# Altium project RaceDAQ 0.1.0.PrjPcb
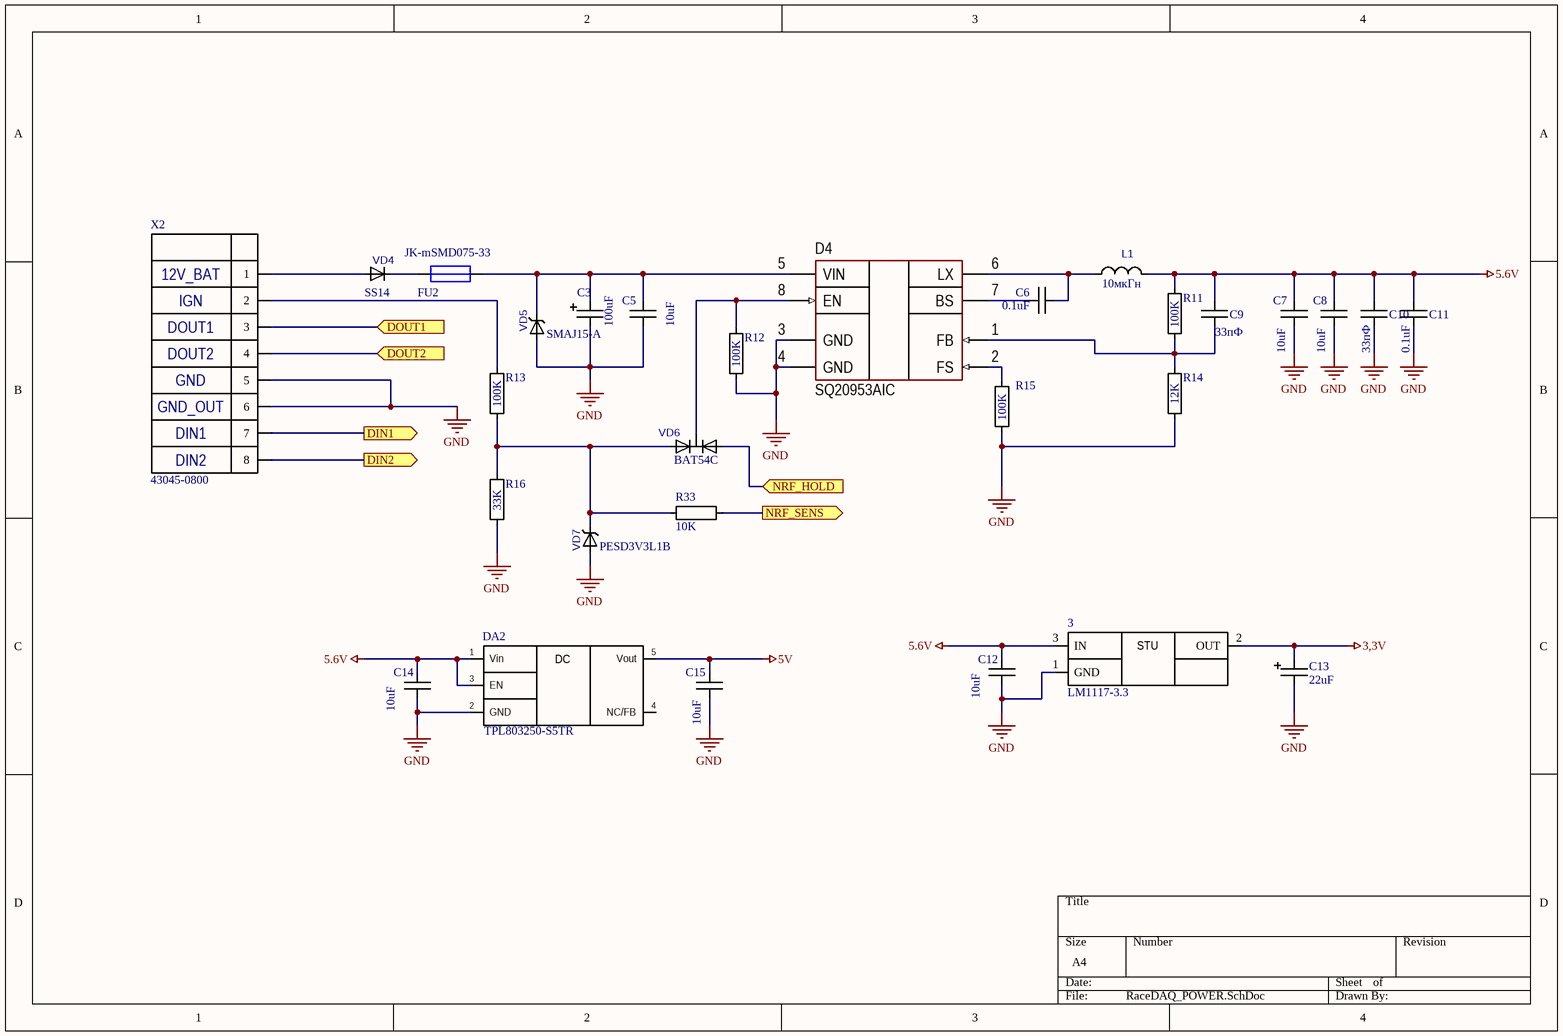
[diagram p0: RaceDAQ_POWER.SchDoc]
4 sheets, 91 parts. Net scope: flat (ports and power ports of the same name join across sheets).
Board file: PCB1.PcbDoc
Sheets:
  RaceDAQ_POWER.SchDoc
  RaceDAQ_IN_OUT.SchDoc
  RaceDAQ_ANALOG.SchDoc
  RaceDAQ_MCU.SchDoc

## Sheet RaceDAQ_POWER.SchDoc
size A4; SheetNumber: 1; SheetTotal: 4

### Parts
3  LM1117-3.3  [SOT230P700X180-4L40N]
C3  100uF  [CAPPRD250W50D680H1250]
C5  10uF  [CAPC3216X130L50N]
C6  0.1uF  [CAPC1608X90L25N]
C7  10uF  [CAPC3216X130L50N]
C8  10uF  [CAPC3216X130L50N]
C9  33пФ  [CAPC1608X90L25N]
C10  33пФ  [CAPC1608X90L25N]
C11  0.1uF  [CAPC1608X90L25N]
C12  10uF  [CAPC3216X130L50N]
C13  22uF  [CAPPM3216X180]
C14  10uF  [CAPC3216X130L50N]
C15  10uF  [CAPC3216X130L50N]
D4  (no value)  [8-SOT]
DA2  TPL803250-S5TR  [SOT95P280X145-5L30N]
FU2  JK-mSMD075-33  [FUSE: 1812]
L1  10мкГн  [MPH0630]
R11  100K  [RESC1608X55L25N]
R12  100K  [RESC1608X55L25N]
R13  100K  [RESC1608X55L25N]
R14  12K  [RESC1608X55L25N]
R15  100K  [RESC1608X55L25N]
R16  33K  [RESC1608X55L25N]
R33  10K  [RESC2012X60L35N]
VD4  SS14  [DIOM5436X247N]
VD5  SMAJ15-A  [DIOM5126X229]
VD6  BAT54C  [SOT95P240X110-3L16]
VD7  PESD3V3L1B  [SODFL1608X65N]
X2  43045-0800  [43045-0800]

### Ports
DIN1 (out), DIN2 (out), DOUT1 (in), DOUT2 (in), NRF_HOLD (in), NRF_SENS (out)

### Nets
3,3V: 3.2(OUT) C13.1
5.6V: 3.3(IN) C7.1 C8.1 C9.1 C10.1 C11.1 C12.1 C14.1 DA2.1(Vin) DA2.3(EN) L1.2 R11.1
5V: C15.1 DA2.5(Vout)
GND: 3.1(GND) C3.2 C5.2 C7.2 C8.2 C10.2 C11.2 C12.2 C13.2 C14.2 C15.2 D4.3(GND) D4.4(GND) DA2.2(GND) R12.2 R14.2 R15.2 R16.2 VD5.A VD7.A X2.5 X2.6
NetC3_1: C3.1 C5.1 D4.5(VIN) FU2.2 VD5.C
NetC6_1: C6.1 D4.7(BS)
NetC6_2: C6.2 D4.6(LX) L1.1
NetC9_2: C9.2 D4.1(FB) R11.2 R14.1
NetD4_2: D4.2(FS) R15.1
NetD4_8: D4.8(EN) R12.1 VD6.3
NetFU2_1: FU2.1 VD4.C
NetFU3_1: X2.3 ; port DOUT1
NetFU4_1: X2.4 ; port DOUT2
NetR13_1: R13.1 X2.2
NetR13_2: R13.2 R16.1 R33.2 VD6.1 VD7.C
NetR23_1: X2.7 ; port DIN1
NetR27_1: X2.8 ; port DIN2
NetR33_1: R33.1 ; port NRF_SENS
NetU_30: VD6.2 ; port NRF_HOLD
NetVD4_A: VD4.A X2.1

Not connected (* = marked no-connect by the designer): DA2 4(NC/FB)

### Notes on the sheet
- (near X2) 12V_BAT
- (near X2) IGN
- (near X2) DOUT1
- (near X2) DOUT2
- (near X2) GND
- (near X2) GND_OUT
- (near X2) DIN1
- (near X2) DIN2
- (in symbol LM1117-3.3) STU
- (in symbol TPS763xx) DC

### Library data of the parts
C3 = Radial 6.3x11: PartNumber: EEUFR1E101; Voltage: 25V; Type: Radial 6.3x11; Value: 100uF
C5 C7 C8 C12 C14 C15 = C1206: PartNumber: GRM31CR61E106KA12L; Type: C1206; Voltage: 25V; Value: 10uF
C6 C11 = C0603: PartNumber: CL10B104KB8NNNC; Type: C0603; Voltage: 50V; Value: 0.1uF
C9 C10 = C0603: PartNumber: CL10C330JB8NNNC,; Type: C0603; Voltage: 50V; Value: 33пФ
C13 = CASEA: PartNumber: 293D226X9010A2TE3; Type: CASEA; Value: 22uF
D4 = SQ20953AIC: Buck converter; Manufacturer: Silergy; ValueManufacturerPartNumber: DC/DC buck converter, input 4...60V, 2.1MHz, output 0.765...55V, 0.6A, -40...+125°C, SOT23-8; VoltageInput: input 4...60V; Frequency: 2.1MHz; CurrentOutput: 0.6A; VoltageOutput: output 0.765...55V; HelpURL: https://www.chipdip.ru/product/sq20953aic-silergy-8027122657; Package: SOT23-8; ComponentType: DC/DC buck converter; Temperature: -40...+125°C; PartNumber: SQ20953AIC
DA2 = TPS763xx: Type: TPL803225-S5TR-S; Value: TPL803250-S5TR
FU2 = JK-mSMD075-33: Предохраниетель ток срабатывания 1,5А, ток удержания 750мА; Manuf: JINRUI; Current: 1.5A
L1 = MPH0630: PartNumber: MWSA0603S-100MT; Type: MPH0630; Value: 10мкГн
R11-R13 R15 = R0603: PartNumber: RC0603FR-07100KL; Type: R0603; Value: 100K
R14 = R0603: PartNumber: RC0603FR-0712KL; Type: R0603; Value: 12K
R16 = R0603: PartNumber: RC0603FR-0733KL; Type: R0603; Value: 33K
R33 = R0805: Type: R0805; Value: 10K
VD4 = SS26T3G: Type: SS26T3G; Value: SS14
VD5 = SMAJ-A: Type: SMAJ-A; Value: SMAJ15-A
VD6 = BAT54: Type: BAT54; Value: BAT54C
VD7 = PESDxS1UB: Type: PESDxS1UB; Value: PESD3V3L1B
3 = LM1117-3.3: Type: LM1117-3.3; Value: LM1117-3.3
X2 = 43045-0800: Type: 43045-0800; Value: 43045-0800

## Sheet RaceDAQ_IN_OUT.SchDoc
size A4; SheetNumber: 2; SheetTotal: 4
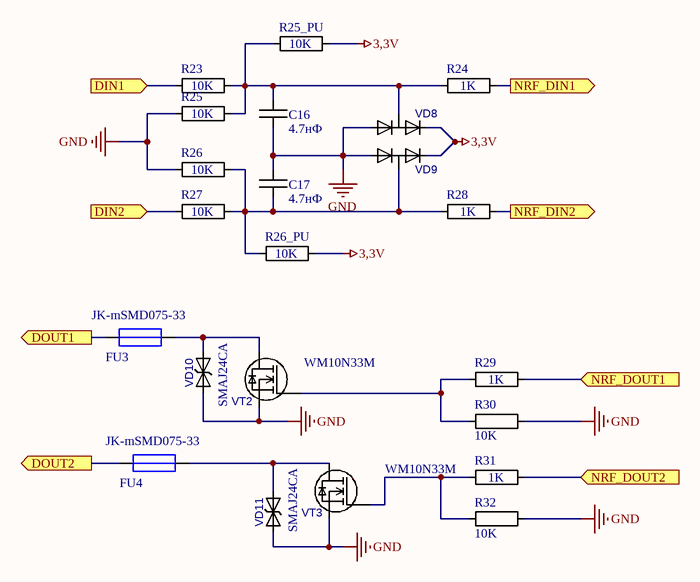
[diagram p1: RaceDAQ_IN_OUT.SchDoc]

### Parts
C16  4.7нФ  [CAPC1608X90L25N]
C17  4.7нФ  [CAPC1608X90L25N]
FU3  JK-mSMD075-33  [FUSE: 1812]
FU4  JK-mSMD075-33  [FUSE: 1812]
R23  10K  [RESC2012X60L35N]
R24  1K  [RESC1608X55L25N]
R25  10K  [RESC2012X60L35N]
R25_PU  10K  [RESC2012X60L35N]
R26  10K  [RESC2012X60L35N]
R26_PU  10K  [RESC2012X60L35N]
R27  10K  [RESC2012X60L35N]
R28  1K  [RESC1608X55L25N]
R29  1K  [RESC1608X55L25N]
R30  10K  [RESC2012X60L35N]
R31  1K  [RESC1608X55L25N]
R32  10K  [RESC2012X60L35N]
VD8  BAT54S  [SOT95P240X110-3L16]  (value not drawn)
VD9  BAT54S  [SOT95P240X110-3L16]  (value not drawn)
VD10  SMAJ24CA  [DIOM5126X229]
VD11  SMAJ24CA  [DIOM5126X229]
VT2  WM10N33M  [SOT95P240X110-3L10]
VT3  WM10N33M  [SOT95P240X110-3L10]

### Ports
DIN1 (in), DIN2 (in), DOUT1 (out), DOUT2 (out), NRF_DIN1 (out), NRF_DIN2 (out), NRF_DOUT1 (in), NRF_DOUT2 (in)

### Nets
3,3V: R25_PU.1 R26_PU.1 VD8.2 VD9.2
GND: C16.1 C17.2 R25.2 R26.1 R30.1 R32.1 VD8.1 VD9.1 VD10.A VD11.A VT2.2 VT3.2
NetC16_2: C16.2 R23.2 R24.1 R25.1 R25_PU.2 VD8.3
NetC17_1: C17.1 R26.2 R26_PU.2 R27.2 R28.1 VD9.3
NetFU3_1: FU3.1 ; port DOUT1
NetFU3_2: FU3.2 VD10.C VT2.3
NetFU4_1: FU4.1 ; port DOUT2
NetFU4_2: FU4.2 VD11.C VT3.3
NetR23_1: R23.1 ; port DIN1
NetR24_2: R24.2 ; port NRF_DIN1
NetR27_1: R27.1 ; port DIN2
NetR28_2: R28.2 ; port NRF_DIN2
NetR29_1: R29.1 R30.2 VT2.1
NetR29_2: R29.2 ; port NRF_DOUT1
NetR31_1: R31.1 R32.2 VT3.1
NetR31_2: R31.2 ; port NRF_DOUT2

### Library data of the parts
C16 C17 = C0603: Type: C0603; Value: 4.7нФ
FU3 FU4 = JK-mSMD075-33: as FU2 on sheet RaceDAQ_POWER
R23 R25 R25_PU R26 R26_PU R27 R30 R32 = R0805: Type: R0805; Value: 10K
R24 R28 R29 R31 = R0603: Type: R0603; Value: 1K
VD10 VD11 = SMAJ-CA: Type: SMAJ-CA; Value: SMAJ24CA
VT2 VT3 = AO3400: Type: AO3400; Value: WM10N33M
VD8 VD9 = BAT54S: Type: BAT54S; Value: BAT54S

## Sheet RaceDAQ_ANALOG.SchDoc
size A4; SheetNumber: 3; SheetTotal: 4
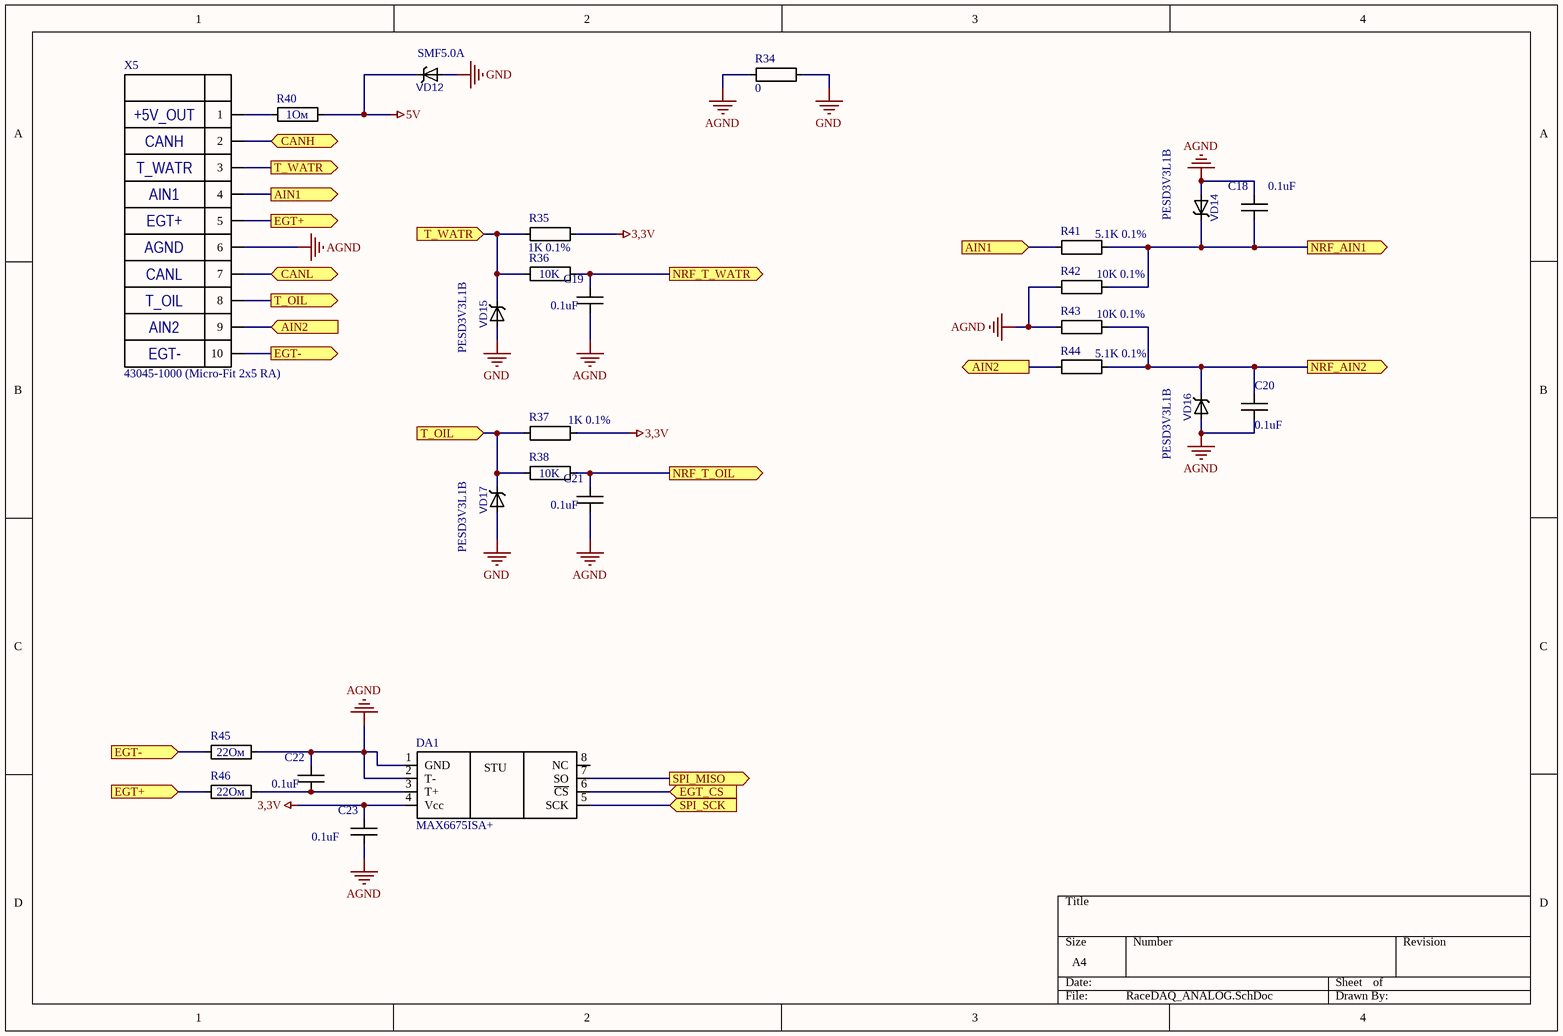
[diagram p2: RaceDAQ_ANALOG.SchDoc]

### Parts
C18  0.1uF  [CAPC1608X90L25N]
C19  0.1uF  [CAPC1608X90L25N]
C20  0.1uF  [CAPC1608X90L25N]
C21  0.1uF  [CAPC1608X90L25N]
C22  0.1uF  [CAPC1608X90L25N]
C23  0.1uF  [CAPC1608X90L25N]
DA1  MAX6675ISA+  [SOIC127P600X175-8L87N]
R34  0  [RESC2012X60L35N]
R35  1K 0.1%  [RESC1608X55L25N]
R36  10K  [RESC2012X60L35N]
R37  1K 0.1%  [RESC1608X55L25N]
R38  10K  [RESC2012X60L35N]
R40  1Ом  [RESC1608X55L25N]
R41  5.1K 0.1%  [RESC1608X55L25N]
R42  10K 0.1%  [RESC1608X55L25N]
R43  10K 0.1%  [RESC1608X55L25N]
R44  5.1K 0.1%  [RESC1608X55L25N]
R45  22Ом  [RESC1608X55L25N]
R46  22Ом  [RESC1608X55L25N]
VD12  SMF5.0A  [SODFL3617X110]
VD14  PESD3V3L1B  [SODFL1608X65N]
VD15  PESD3V3L1B  [SODFL1608X65N]
VD16  PESD3V3L1B  [SODFL1608X65N]
VD17  PESD3V3L1B  [SODFL1608X65N]
X5  43045-1000 (Micro-Fit 2x5 RA)  [43045-1000]

### Ports
AIN1 (in), AIN1 (out), AIN2 (in), AIN2 (out), CANH (bidir), CANL (bidir), EGT+ (in), EGT+ (out), EGT- (in), EGT- (out), EGT_CS (in), NRF_AIN1 (out), NRF_AIN2 (out), NRF_T_OIL (out), NRF_T_WATR (out), SPI_MISO (out), SPI_SCK (in), T_OIL (in), T_OIL (out), T_WATR (in), T_WATR (out)

### Nets
3,3V: C23.2 DA1.4(Vcc) R35.2 R37.2
5V: R40.2 VD12.C
AGND: C18.2 C19.1 C20.1 C21.1 C22.2 C23.1 DA1.1(GND) DA1.2(T-) R34.2 R42.1 R43.1 R45.2 VD14.A VD16.A X5.6
GND: R34.1 VD12.A VD15.A VD17.A
NetC18_1: C18.1 R41.2 R42.2 VD14.C ; port NRF_AIN1
NetC19_2: C19.2 R36.2 ; port NRF_T_WATR
NetC20_2: C20.2 R43.2 R44.2 VD16.C ; port NRF_AIN2
NetC21_2: C21.2 R38.2 ; port NRF_T_OIL
NetC22_1: C22.1 DA1.3(T+) R46.2
NetD2_2: DA1.5(SCK) ; port SPI_SCK
NetD2_4: DA1.7(SO) ; port SPI_MISO
NetD2_8: X5.7 ; port CANL
NetD2_9: X5.2 ; port CANH
NetDA1_6: DA1.6(~{CS}) ; port EGT_CS
NetR35_1: R35.1 R36.1 VD15.C X5.3 ; port T_WATR
NetR37_1: R37.1 R38.1 VD17.C X5.8 ; port T_OIL
NetR40_1: R40.1 X5.1
NetR41_1: R41.1 X5.4 ; port AIN1
NetR44_1: R44.1 X5.9 ; port AIN2
NetR45_1: R45.1 X5.10 ; port EGT-
NetR46_1: R46.1 X5.5 ; port EGT+

Not connected (* = marked no-connect by the designer): DA1 8(NC)

### Notes on the sheet
- (near X5) +5V_OUT
- (near X5) CANH
- (near X5) T_WATR
- (near X5) AIN1
- (near X5) EGT+
- (near X5) AGND
- (near X5) CANL
- (near X5) T_OIL
- (near X5) AIN2
- (near X5) EGT-
- (in symbol MAX6675ISA+) STU

### Library data of the parts
C18-C23 = C0603: as C6 on sheet RaceDAQ_POWER; Value: 0.1uF
R34 R36 R38 = R0805: Type: R0805
  R34: Value: 0
  R36 R38: Value: 10K
R35 R37 R40 = R0603: PartNumber: RT0603BRD071KL; Type: R0603
  R35 R37: Value: 1K 0.1%
  R40: Value: 1Ом
R41 R44 = R0603: PartNumber: RT0603BRD075K1L; Type: R0603; Value: 5.1K 0.1%
R42 R43 = R0603: PartNumber: RT0603BRD0710KL; Type: R0603; Value: 10K 0.1%
R45 R46 = R0603: Type: R0603; Value: 22Ом
VD12 = SMFxxA: Type: SMFxxA; Value: SMF5.0A
VD14-VD17 = PESDxS1UB: Type: PESDxS1UB; Value: PESD3V3L1B
X5 = 43045-1000: Type: 43045-1000; Value: 43045-1000 (Micro-Fit 2x5 RA)
DA1 = MAX6675ISA+: Type: MAX6675ISA+; Value: MAX6675ISA+

## Sheet RaceDAQ_MCU.SchDoc
size A4; SheetNumber: 4; SheetTotal: 4
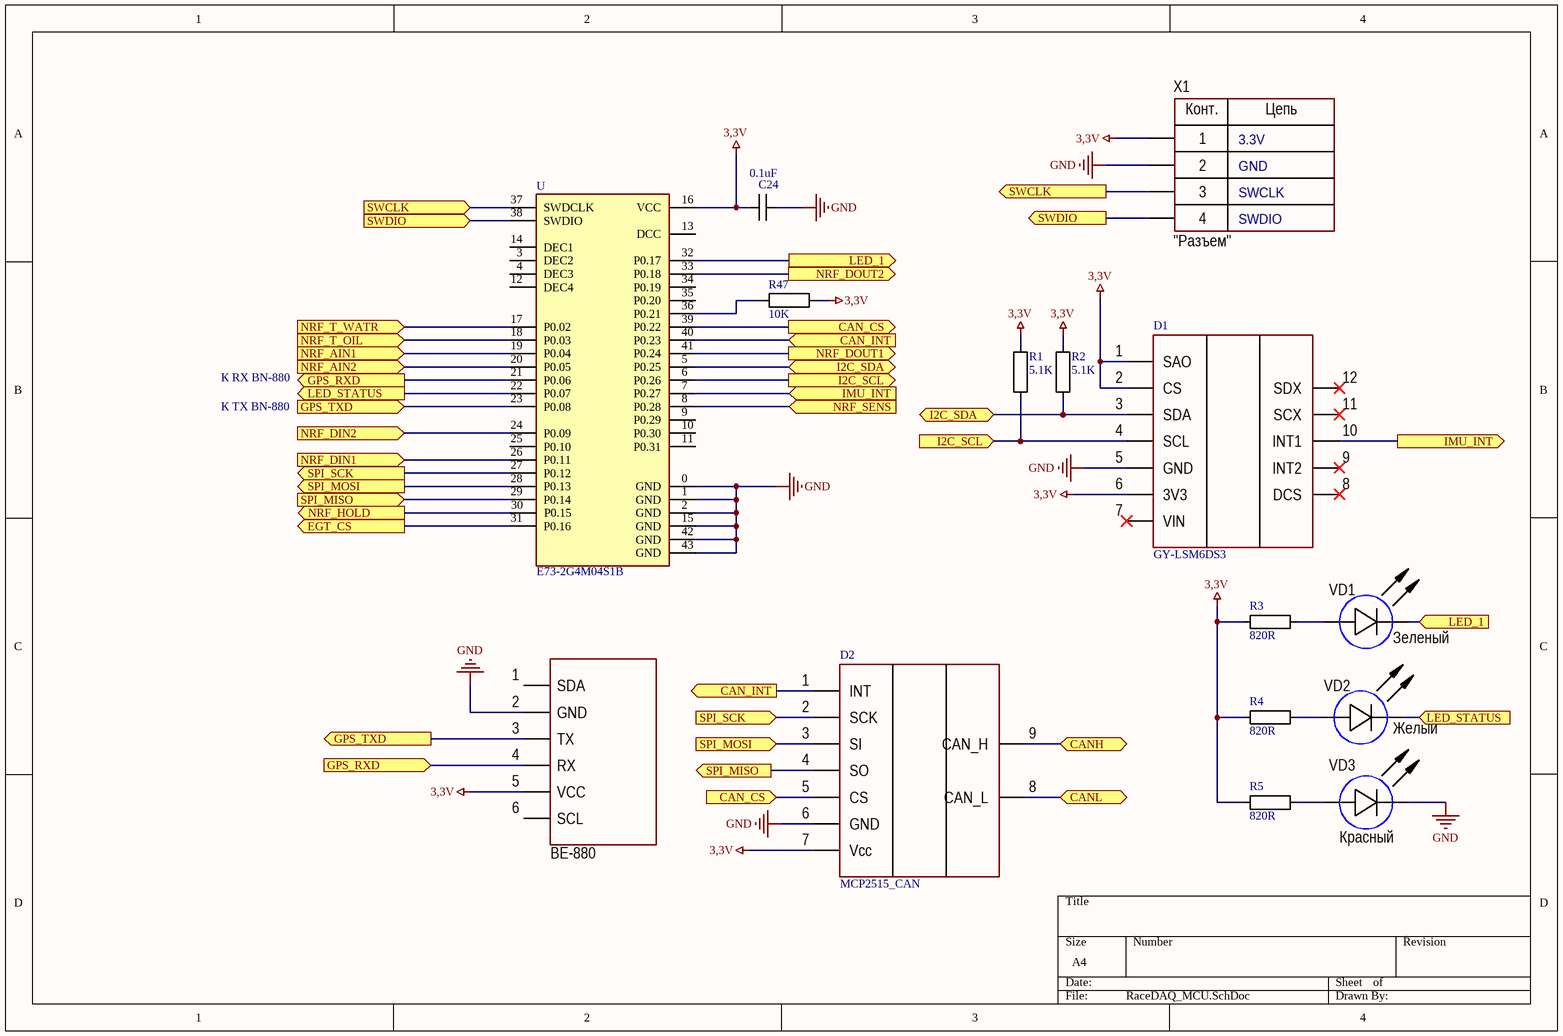
[diagram p3: RaceDAQ_MCU.SchDoc]

### Parts
BE-880  (no value)  [GPS:BE880]
C24  0.1uF  [CAPC1608X90L25N]
D1  GY-LSM6DS3  [AXL:LSM6DS3]
D2  MCP2515_CAN  [MDL:MCP2515]
R1  5.1K  [RESC2012X60L35N]
R2  5.1K  [RESC2012X60L35N]
R3  820R  [RESC2012X60L35N]
R4  820R  [RESC2012X60L35N]
R5  820R  [RESC2012X60L35N]
R47  10K  [RESC2012X60L35N]
U  E73-2G4M04S1B  [XCVR_E73-2G4M04S1B]
VD1  Color: Зеленый  [DIODE: LED3MM_Y]
VD2  Color: Желый  [DIODE: LED3MM_Y]
VD3  Color: Красный  [DIODE: LED3MM_Y]
X1  CommentText: "Разъем"  [CON: PLS-4]

### Ports
CAN_CS (in), CAN_CS (out), CAN_INT (in), CAN_INT (out), CANH (bidir), CANL (bidir), EGT_CS (out), GPS_RXD (in), GPS_RXD (out), GPS_TXD (in), GPS_TXD (out), I2C_SCL (in), I2C_SCL (out), I2C_SDA (bidir), IMU_INT (in), IMU_INT (out), LED_1 (in), LED_1 (out), LED_STATUS (in), LED_STATUS (out), NRF_AIN1 (in), NRF_AIN2 (in), NRF_DIN1 (in), NRF_DIN2 (in), NRF_DOUT1 (out), NRF_DOUT2 (out), NRF_HOLD (out), NRF_SENS (in), NRF_T_OIL (in), NRF_T_WATR (in), SPI_MISO (in), SPI_MISO (out), SPI_MOSI (in), SPI_MOSI (out), SPI_SCK (in), SPI_SCK (out), SWCLK (in), SWCLK (out), SWDIO (in), SWDIO (out)

### Nets
3,3V: BE-880.5(VCC) C24.2 D1.1(SAO) D1.2(CS) D1.6(3V3) D2.7(Vcc) R1.2 R2.2 R3.1 R4.1 R5.1 R47.1 X1.1
GND: BE-880.2(GND) C24.1 D1.5(GND) D2.6(GND) U.15(GND) U.42(GND) U.43(GND) VD3.2(C) X1.2
NetBE-880_3: BE-880.3(TX) U.23(P0.08) ; port GPS_TXD
NetBE-880_4: BE-880.4(RX) U.21(P0.06) ; port GPS_RXD
NetC18_1: U.19(P0.04) ; port NRF_AIN1
NetC19_2: U.17(P0.02) ; port NRF_T_WATR
NetC20_2: U.20(P0.05) ; port NRF_AIN2
NetC21_2: U.18(P0.03) ; port NRF_T_OIL
NetD1_3: D1.3(SDA) R2.1 U.5(P0.25) ; port I2C_SDA
NetD1_4: D1.4(SCL) R1.1 U.6(P0.26) ; port I2C_SCL
NetD1_10: D1.10(INT1) U.7(P0.27) ; port IMU_INT
NetD2_1: D2.1(INT) U.40(P0.23) ; port CAN_INT
NetD2_2: D2.2(SCK) U.27(P0.12) ; port SPI_SCK
NetD2_3: D2.3(SI) U.28(P0.13) ; port SPI_MOSI
NetD2_4: D2.4(SO) U.29(P0.14) ; port SPI_MISO
NetD2_5: D2.5(CS) U.39(P0.22) ; port CAN_CS
NetD2_8: D2.8(CAN_L) ; port CANL
NetD2_9: D2.9(CAN_H) ; port CANH
NetDA1_6: U.31(P0.16) ; port EGT_CS
NetR3_2: R3.2 VD1.1(A)
NetR4_2: R4.2 VD2.1(A)
NetR5_2: R5.2 VD3.1(A)
NetR24_2: U.26(P0.11) ; port NRF_DIN1
NetR28_2: U.24(P0.09) ; port NRF_DIN2
NetR29_2: U.41(P0.24) ; port NRF_DOUT1
NetR31_2: U.33(P0.18) ; port NRF_DOUT2
NetR33_1: U.8(P0.28) ; port NRF_SENS
NetR47_2: R47.2 U.36(P0.21)
NetU_22: U.22(P0.07) VD2.2(C) ; port LED_STATUS
NetU_30: U.30(P0.15) ; port NRF_HOLD
NetU_37: U.37(SWDCLK) X1.3 ; port SWCLK
NetU_38: U.38(SWDIO) X1.4 ; port SWDIO
NetVD1_2: VD1.2(C) ; port LED_1

Not connected (* = marked no-connect by the designer): BE-880 1(SDA) 6(SCL); D1 7(VIN)* 8(DCS)* 9(INT2)* 11(SCX)* 12(SDX)*; U 0(GND) 1(GND) 2(GND) 3(DEC2) 4(DEC3) 9(P0.29) 10(P0.30) 11(P0.31) 12(DEC4) 13(DCC) 14(DEC1) 16(VCC) 25(P0.10) 32(P0.17) 34(P0.19) 35(P0.20)

### Notes on the sheet
- 3.3V
- GND
- SWCLK
- SWDIO
- К RX BN-880
- К TX BN-880
- (in symbol PLS-4) Конт.; Цепь

### Library data of the parts
BE-880 = BE-880: Gate driver; VoltageSupply: supply -12...+20V; Frequency: 1MHz; CurrentOutput: ±2A; VoltageWork: 1200V; CMTI: 100kV/μs; Temperature: -40...+150°C
C24 = C0603: as C6 on sheet RaceDAQ_POWER; Value: 0.1uF
D2 = MCP2515_Mod
R1-R5 R47 = R0805: Type: R0805
  R1 R2: Value: 5.1K
  R3-R5: Value: 820R
  R47: Value: 10K
U = E73-2G4M04S1B: nRF52832 BLE 4.2/5.0 SMD Wireless Module; MF: EBYTE; Availability: Unavailable; Price: None; Package: Package; MP: E73-2G4M04S1B; Value: *; SnapEDA_Link: https://www.snapeda.com/parts/E73-2G4M04S1B/EBYTE/view-part/4219264/?ref=snap
VD1-VD3 = LED_single_3mm: ValueManufacturerPartNumber: LED, Green, *, *, *, -55...+150°C; TypeDiode: LED; ColorParameter: Green; Manufacturer: *; Package: *; HelpURL: *; Temperature: -55...+150°C; Current: *; VoltageDrop: *; PartNumber: *
X1 = PLS-4: Manufacturer: Connfly; ValueManufacturerPartNumber: Connector, 4pin, 2.54mm, 500VAC, 3A; TypeConnector: Connector; VoltageMax: 500VAC; Pitch: 2.54mm; CurrentMax: 3A; Multichannel: 4pin; HelpURL: https://www.chipdip.ru/product/pls-4; PartNumber: PLS-4

## Nets that join several sheets
3,3V: RaceDAQ_POWER (3.2 C13.1), RaceDAQ_IN_OUT (R25_PU.1 R26_PU.1 VD8.2 VD9.2), RaceDAQ_ANALOG (C23.2 DA1.4 R35.2 R37.2), RaceDAQ_MCU (13 pins)
5V: RaceDAQ_POWER (C15.1 DA2.5), RaceDAQ_ANALOG (R40.2 VD12.C)
GND: RaceDAQ_POWER (22 pins), RaceDAQ_IN_OUT (12 pins), RaceDAQ_ANALOG (R34.1 VD12.A VD15.A VD17.A), RaceDAQ_MCU (9 pins)
NetC18_1: RaceDAQ_ANALOG (C18.1 R41.2 R42.2 VD14.C), RaceDAQ_MCU (U.19)
NetC19_2: RaceDAQ_ANALOG (C19.2 R36.2), RaceDAQ_MCU (U.17)
NetC20_2: RaceDAQ_ANALOG (C20.2 R43.2 R44.2 VD16.C), RaceDAQ_MCU (U.20)
NetC21_2: RaceDAQ_ANALOG (C21.2 R38.2), RaceDAQ_MCU (U.18)
NetD2_2: RaceDAQ_ANALOG (DA1.5), RaceDAQ_MCU (D2.2 U.27)
NetD2_4: RaceDAQ_ANALOG (DA1.7), RaceDAQ_MCU (D2.4 U.29)
NetD2_8: RaceDAQ_ANALOG (X5.7), RaceDAQ_MCU (D2.8)
NetD2_9: RaceDAQ_ANALOG (X5.2), RaceDAQ_MCU (D2.9)
NetDA1_6: RaceDAQ_ANALOG (DA1.6), RaceDAQ_MCU (U.31)
NetFU3_1: RaceDAQ_POWER (X2.3), RaceDAQ_IN_OUT (FU3.1)
NetFU4_1: RaceDAQ_POWER (X2.4), RaceDAQ_IN_OUT (FU4.1)
NetR23_1: RaceDAQ_POWER (X2.7), RaceDAQ_IN_OUT (R23.1)
NetR24_2: RaceDAQ_IN_OUT (R24.2), RaceDAQ_MCU (U.26)
NetR27_1: RaceDAQ_POWER (X2.8), RaceDAQ_IN_OUT (R27.1)
NetR28_2: RaceDAQ_IN_OUT (R28.2), RaceDAQ_MCU (U.24)
NetR29_2: RaceDAQ_IN_OUT (R29.2), RaceDAQ_MCU (U.41)
NetR31_2: RaceDAQ_IN_OUT (R31.2), RaceDAQ_MCU (U.33)
NetR33_1: RaceDAQ_POWER (R33.1), RaceDAQ_MCU (U.8)
NetU_30: RaceDAQ_POWER (VD6.2), RaceDAQ_MCU (U.30)